# Altium schematic sheet Humidity_Sensor.SchDoc
size A
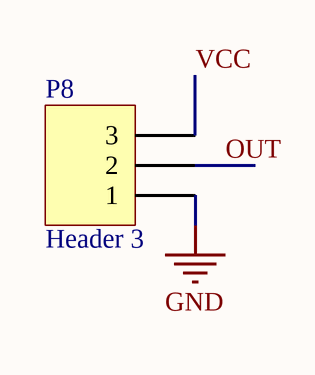
[diagram p0: Humidity_Sensor.SchDoc]

## Parts
P8  Header 3  [HDR1X3]

## Nets
GND: P8.1
OUT: P8.2
VCC: P8.3

## Library data of the parts
P8 = Header 3: Header, 3-Pin; LatestRevisionDate: 17-Jul-2002; LatestRevisionNote: Re-released for DXP Platform.; Publisher: Altium Limited